# EasyEDA Pro project ProProject_过压欠压比较器20210517_2024-08-10.epro

# Schematic Schematic23
Create Date: 2024-05-17; Page Name: P1; Project Name: 过压欠压比较器20210517; Schematic Name: Schematic23; Update Date: 2024-05-17; Company: 嘉立创EDA; Page Size: A4; Version: V1.0
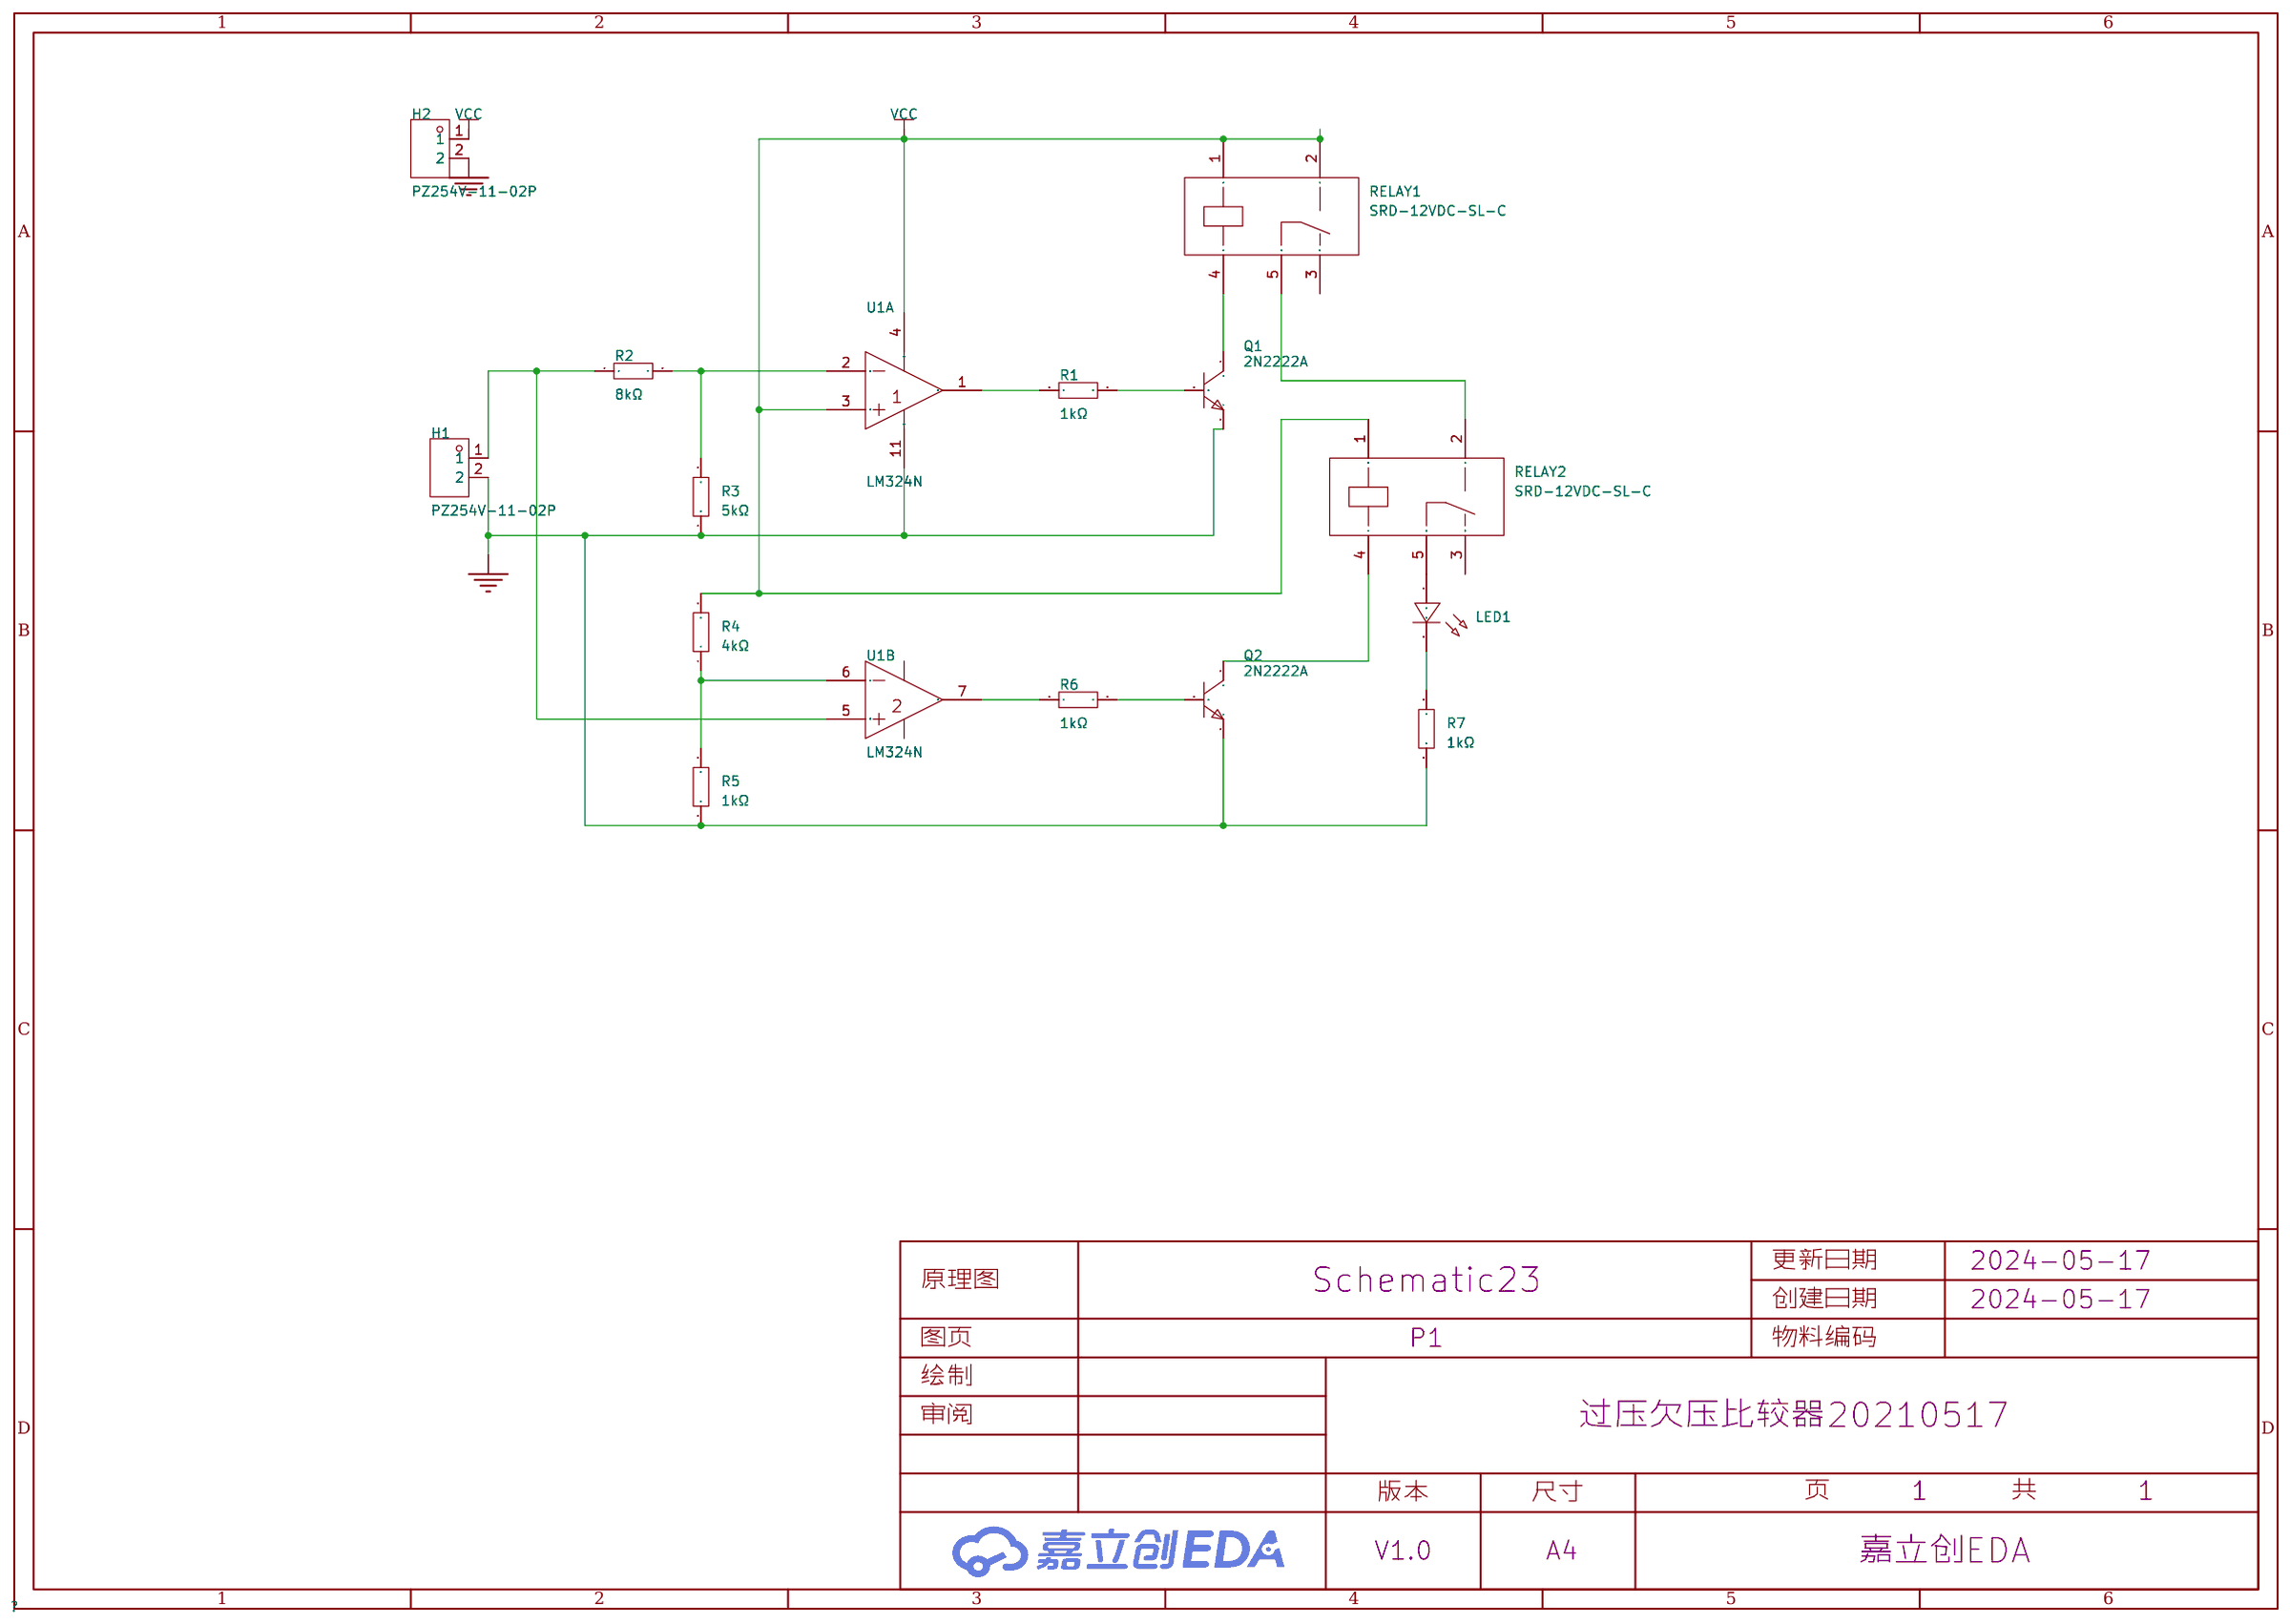
[diagram p0: schematic sheet]

## Parts
H1  PZ254V-11-02P  [HDR-TH_2P-P2.54-V-M]
H2  PZ254V-11-02P  [HDR-TH_2P-P2.54-V-M]
LED1  -  [LED_TH-3mm]
Q1  2N2222A  [TO-92-3_L4.8-W3.7-P2.54-R]
Q2  2N2222A  [TO-92-3_L4.8-W3.7-P2.54-R]
R1  1kΩ  [Res_1/8W]
R2  8kΩ  [Res_1/8W]
R3  5kΩ  [Res_1/8W]
R4  4kΩ  [Res_1/8W]
R5  1kΩ  [Res_1/8W]
R6  1kΩ  [Res_1/8W]
R7  1kΩ  [Res_1/8W]
RELAY1  SRD-12VDC-SL-C  [RELAY-TH_SRD-XXVDC-XL-C]
RELAY2  SRD-12VDC-SL-C  [RELAY-TH_SRD-XXVDC-XL-C]
U1  LM324N  [DIP-14_L19.4-W6.4-P2.54-LS7.6-BL]  (sections 1,2)

## Library data of the parts
H1 H2 = PZ254V-11-02P: 插针结构:1x2P;间距:2.54mm;行距:-;圆针/方针:方针;安装类型:直插;排数:单排;总PIN位数:2P;额定电流:-;额定电压:-;配合针长度:6mm;塑高:2.5mm;端接针长度:3mm;触头材质:黄铜;触头镀层:-;工作温度范围:-40℃~+105℃;颜色:黑色;; LCSC Part Name: 间距:2.54mm 1x2P 直插 方针; Supplier Part: C492401; Manufacturer: XFCN(兴飞); Supplier Footprint: 插件,P=2.54mm; JLCPCB Part Class: 扩展库; Datasheet: https://atta.szlcsc.com/upload/public/pdf/source/20200309/C492401_A812433581A9B211A7FFA413ADDFF0E5.pdf; Supplier: LCSC; Pin Structure: 1x2P; Pitch: 2.54mm; Circluar Pins/Square Pins: 方针; Mounting Type: 直插; Number of Rows: 单排; Number of Pins: 2P; Length of Mating Pin: 6mm; Insulation Height: 2.5mm; Length of End Connection Pin: 3mm; Contact Material: 黄铜; Operating Temperature Range: -40℃~+105℃; Color: 黑色
LED1 = LED_TH-R_3mm: Supplier Footprint: 插件
Q1 Q2 = 2N2222A_C358533: 晶体管类型:NPN;集电极电流(Ic):600mA;集射极击穿电压(Vceo):40V;功率(Pd):625mW;直流电流增益(hFE@Ic,Vce):100@150mA,10V;; LCSC Part Name: NPN 电流:600mA 耐压:40V (100-300); Supplier Part: C358533; Manufacturer: BLUE ROCKET(蓝箭); Supplier Footprint: TO-92-3; JLCPCB Part Class: 扩展库; Datasheet: https://atta.szlcsc.com/upload/public/pdf/source/20190129/C358533_AFAFE39542E316DF9E781A186BBE98F7.pdf; Supplier: LCSC; Transistor Type: NPN; Collector Current (Ic): 600mA; Collector-Emitter Breakdown Voltage (Vceo): 40V; Power Dissipation (Pd): 625mW; DC Current Gain (hFE@Ic,Vce): 100@150mA,10V; Transition Frequency (fT): 300MHz; Collector Cut-Off Current (Icbo): 100nA; Collector-Emitter Saturation Voltage (VCE(sat)@Ic,Ib): 600mV@500mA,50mA
R1-R7 = Res_AXIAL-1/8W: Supplier Footprint: 轴向引线
RELAY1 RELAY2 = SRD-12VDC-SL-C: 线圈电压:12V;触点形式:一组转换:1C(单刀双掷-转换);触点容量(电阻负载):-;最大切换电压:250V@AC;最大切换电流:15A;; Supplier Part: C30431; Manufacturer: 松乐; Supplier Footprint: 插件,15.6x19.2mm; JLCPCB Part Class: 扩展库; Datasheet: https://atta.szlcsc.com/upload/public/pdf/source/20200305/C490149_C96E4098A3B1FFB377D5AD2E40B7C2A8.pdf; Supplier: LCSC; Coil Voltage: 12V; Contact Form: 一组转换:1C(单刀双掷-转换); Pin Number: 5; Maximum Switching Voltage: 250V@AC; Coil Rated Power: 360mW; Maximum Switching Current: 15A; Coil Type: 无极性-单线圈; Coil Resistance: 400Ω; Contact Resistance: 100mΩ; Operate Time: 10ms; Release Time: 10ms
U1 = LM324N_C725320: 放大器数:-;; LCSC Part Name: 四路运算放大器; Supplier Part: C725320; Manufacturer: HGSEMI(华冠); Supplier Footprint: DIP-14; JLCPCB Part Class: Extended Part; Datasheet: https://atta.szlcsc.com/upload/public/pdf/source/20200820/C725320_F412C3792749730AA8E5D3FBC02E9B6A.pdf; Supplier: LCSC

## Nets
GND: H1.2 H2.2 Q1.3(E) Q2.3(E) R3.1 R5.1 R7.1 U1.11(GND)
VCC: H2.1 R4.2 RELAY1.1 RELAY1.2 RELAY2.1 U1.3(IN1+) U1.4(VCC)
$1N727: Q1.1(C) RELAY1.4
$1N730: R1.1 U1.1(OUT1)
$1N733: Q1.2(B) R1.2
$1N787: R2.2 R3.2 U1.2(IN1-)
$1N811: H1.1 R2.1 U1.5(IN2+)
$1N825: R4.1 R5.2 U1.6(IN2-)
$1N910: R6.1 U1.7(OUT2)
$1N912: Q2.2(B) R6.2
$1N916: Q2.1(C) RELAY2.4
$1N945: LED1.1(C) RELAY2.5
$1N994: LED1.2(A) R7.2
$1N1032: RELAY1.5 RELAY2.2

Not connected (* = marked no-connect by the designer): RELAY1 3; RELAY2 3

# Board PCB38
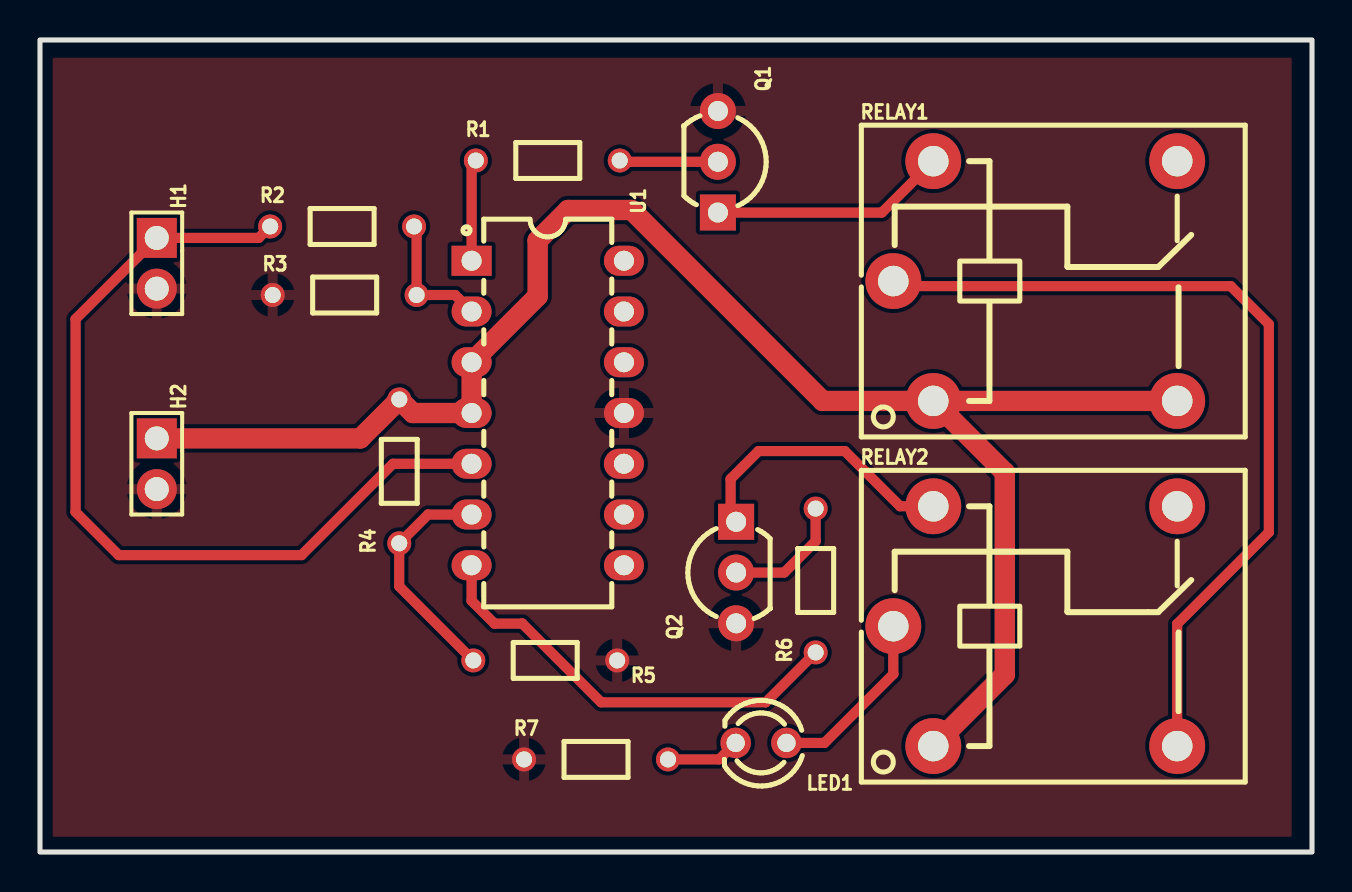
[diagram p1: board, top side]
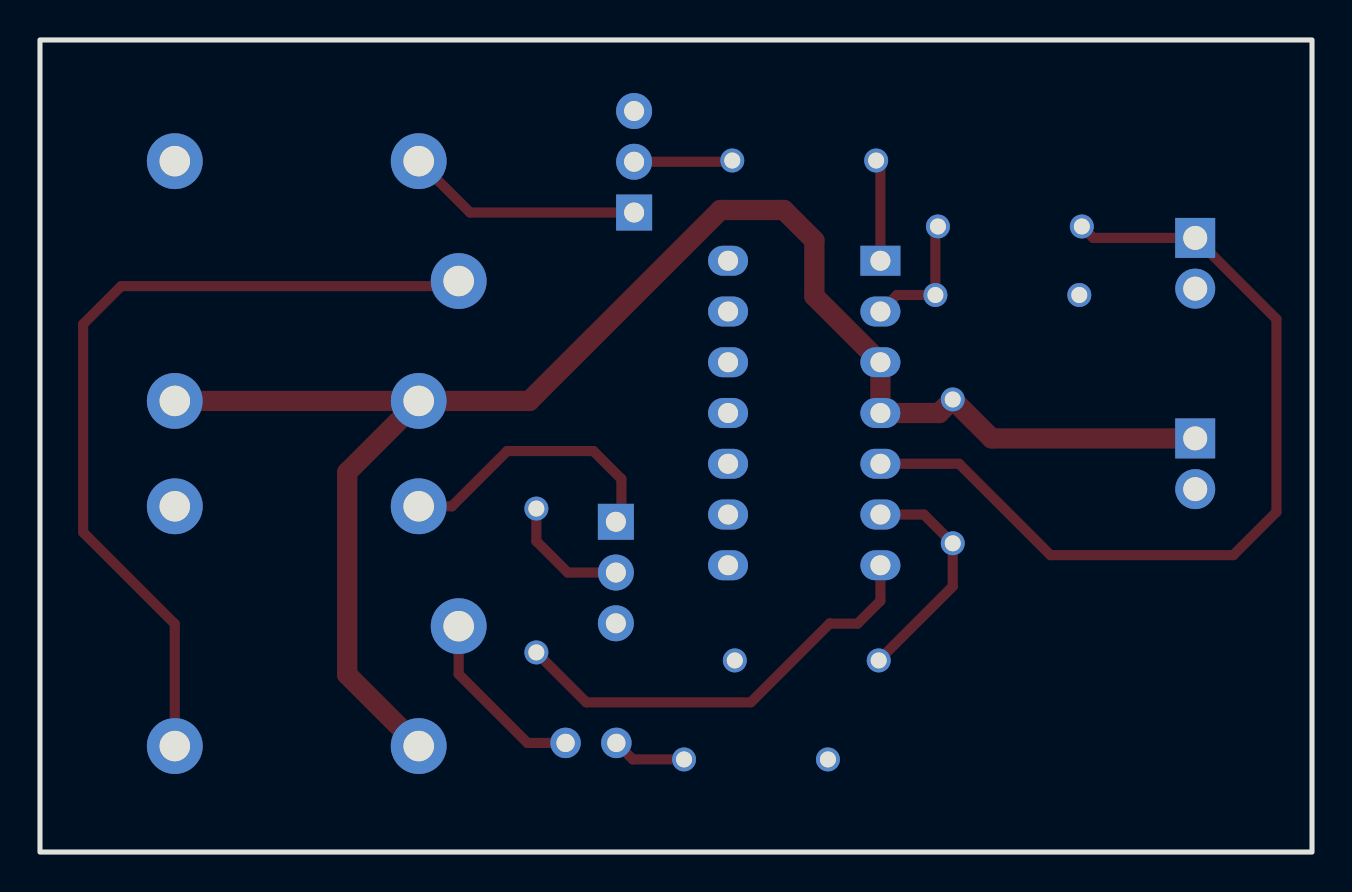
[diagram p2: board, bottom side, seen from below]

Outline 63.63 x 40.64 mm; copper layers: Top Layer, Bottom Layer. Coordinates in mm from the lower left corner of the outline.
Outline path: rectangle 0,40.64 63.63,0
Stack: Top Layer 0.035mm / Dielectric1 1.51mm FR4 er 4.5 / Bottom Layer 0.035mm

## Design rules (mm)
template: JLCPCB Capability(Two Layers Board)
spacing copperThickness1oz (default): track to track 0.102, other pairs 0.152 to 0.3
spacing copperThickness2oz: track to track 0.203, other pairs 0.152 to 0.3
track width copperThickness1oz (default): min 0.127, default 0.254, max 2.54
track width copperThickness2oz: min 0.203, default 0.254, max 2.54
differential pair differentialPair (default): width min 0.127, default 0.254, max 2.54; gap min 0.152, default 0.152
via viaSize (default): diameter min 0.5, default 0.61, max 10; hole min 0.3, default 0.305, max 6.3

## Placement (name value [footprint] x y rotation side)
H1  PZ254V-11-02P  [HDR-TH_2P-P2.54-V-M]  5.84 29.46 270 top
H2  PZ254V-11-02P  [HDR-TH_2P-P2.54-V-M]  5.84 19.43 270 top
LED1  -  [LED_TH-3mm]  36.07 5.46 180 top
Q1  2N2222A  [TO-92-3_L4.8-W3.7-P2.54-R]  33.91 34.54 270 top
Q2  2N2222A  [TO-92-3_L4.8-W3.7-P2.54-R]  34.82 13.99 90 top
R1  1kΩ  [Res_1/8W]  25.4 34.54 0 top
R2  8kΩ  [Res_1/8W]  15.11 31.24 0 top
R3  5kΩ  [Res_1/8W]  15.24 27.81 0 top
R4  4kΩ  [Res_1/8W]  18.03 19.05 90 top
R5  1kΩ  [Res_1/8W]  25.27 9.65 180 top
R6  1kΩ  [Res_1/8W]  38.86 13.59 90 top
R7  1kΩ  [Res_1/8W]  27.81 4.57 0 top
RELAY1  SRD-12VDC-SL-C  [RELAY-TH_SRD-XXVDC-XL-C]  49.78 28.57 0 top
RELAY2  SRD-12VDC-SL-C  [RELAY-TH_SRD-XXVDC-XL-C]  49.78 11.3 0 top
U1  LM324N  [DIP-14_L19.4-W6.4-P2.54-LS7.6-BL]  25.4 21.97 270 top

## Footprints (pads in the part's own frame, mm; a bottom-side part is the same pattern mirrored in y, then rotated)
DIP-14_L19.4-W6.4-P2.54-LS7.6-BL
  rect 1.5x2 hole 1: 1(-7.62,-3.811)
  oval 1.5x2 hole 1: 2(-5.08,-3.811) 3(-2.54,-3.811) 4(0,-3.811) 5(2.54,-3.811) 6(5.08,-3.811) 7(7.62,-3.811) 8(7.62,3.811) 9(5.08,3.809) 10(2.54,3.809) 11(0,3.809) 12(-2.54,3.809) 13(-5.08,3.809) 14(-7.62,3.809)
HDR-TH_2P-P2.54-V-M
  rect 2x2 hole 1.2: 1(-1.27,0)
  round 2 hole 1.2: 2(1.27,0)
LED_TH-3mm
  round 1.524 hole 0.914: 1(-1.27,0) 2(1.27,0)
RELAY-TH_SRD-XXVDC-XL-C
  round 2.794 hole 1.524: 1(-5.1,-6) 2(7.1,-6) 3(7.1,6) 4(-5.1,6) 5(-7.1,0)
Res_1/8W
  round 1.199 hole 0.8: 1(-3.599,0.063) 2(3.599,0.063)
TO-92-3_L4.8-W3.7-P2.54-R
  rect 1.8x1.8 hole 1: 1(2.54,0)
  round 1.8 hole 1: 2(0,0) 3(-2.54,0)

## Nets
As in the schematic.

Pads without a net: RELAY1 3; RELAY2 3; U1 8 9 10 12 13 14

## Routing (per net, layer and track width the routed paths; a pad name or vN(x,y) marks a point on that pad's centre or on a via; arc(x,y) is an arc through that point)
VCC: length 83.7
  Top Layer w1.016: RELAY1.1 39.15,22.57 29.59,32.13 26.42,32.13 24.89,30.61 24.89,27.81 U1.3 U1.4 18.65,21.97 R4.2 16.02,20.7 H2.1 ; RELAY1.1 48.26,19 48.26,8.88 RELAY2.1 ; RELAY1.1 RELAY1.2
$1N727: length 11.8
  Top Layer w0.508: RELAY1.4 42.11,32 Q1.1
$1N730: length 5.1
  Top Layer w0.508: 21.8,34.61 21.59,34.4 U1.1
$1N733: length 4.9
  Top Layer w0.508: Q1.2 29.06,34.54 R1.2
$1N787: length 6.6
  Top Layer w0.508: R2.2 18.84,31.18 18.84,27.88 20.76,27.88 U1.2
$1N811: length 43.9
  Top Layer w0.508: U1.5 17.65,19.43 13.08,14.86 3.94,14.86 1.78,17.02 1.78,26.67 H1.1 10.94,30.73 R2.1
$1N825: length 11.6
  Top Layer w0.508: U1.6 19.41,16.89 R4.1 17.97,13.29 R5.2
$1N910: length 22.1
  Top Layer w0.508: R6.1 36.3,7.49 28.07,7.49 24.12,11.44 24.12,11.43 22.73,11.43 21.59,12.57 U1.7
$1N912: length 6.3
  Top Layer w0.508: 38.8,17.19 38.8,15.56 37.23,13.99 Q2.2
$1N916: length 14.1
  Top Layer w0.508: Q2.1 34.54,16.8 34.54,18.67 35.94,20.07 40.26,20.07 43.02,17.3 RELAY2.4
$1N945: length 9.2
  Top Layer w0.508: LED1.1 39.24,5.46 42.68,8.9 RELAY2.5
$1N994: length 3.7
  Top Layer w0.508: LED1.2 33.97,4.63 R7.2
$1N1032: length 42.7
  Top Layer w0.508: RELAY2.2 56.88,11.42 61.47,16 61.47,26.42 59.56,28.32 42.94,28.32 RELAY1.5

## Copper pours and planes (outline as drawn; the poured copper is in the pictures)
GND on Top Layer: 0.64,39.75 62.61,39.75 62.61,0.76 0.64,0.76
